# EAGLE schematic nomis-memory-game-v01 (EAGLE 6.0)
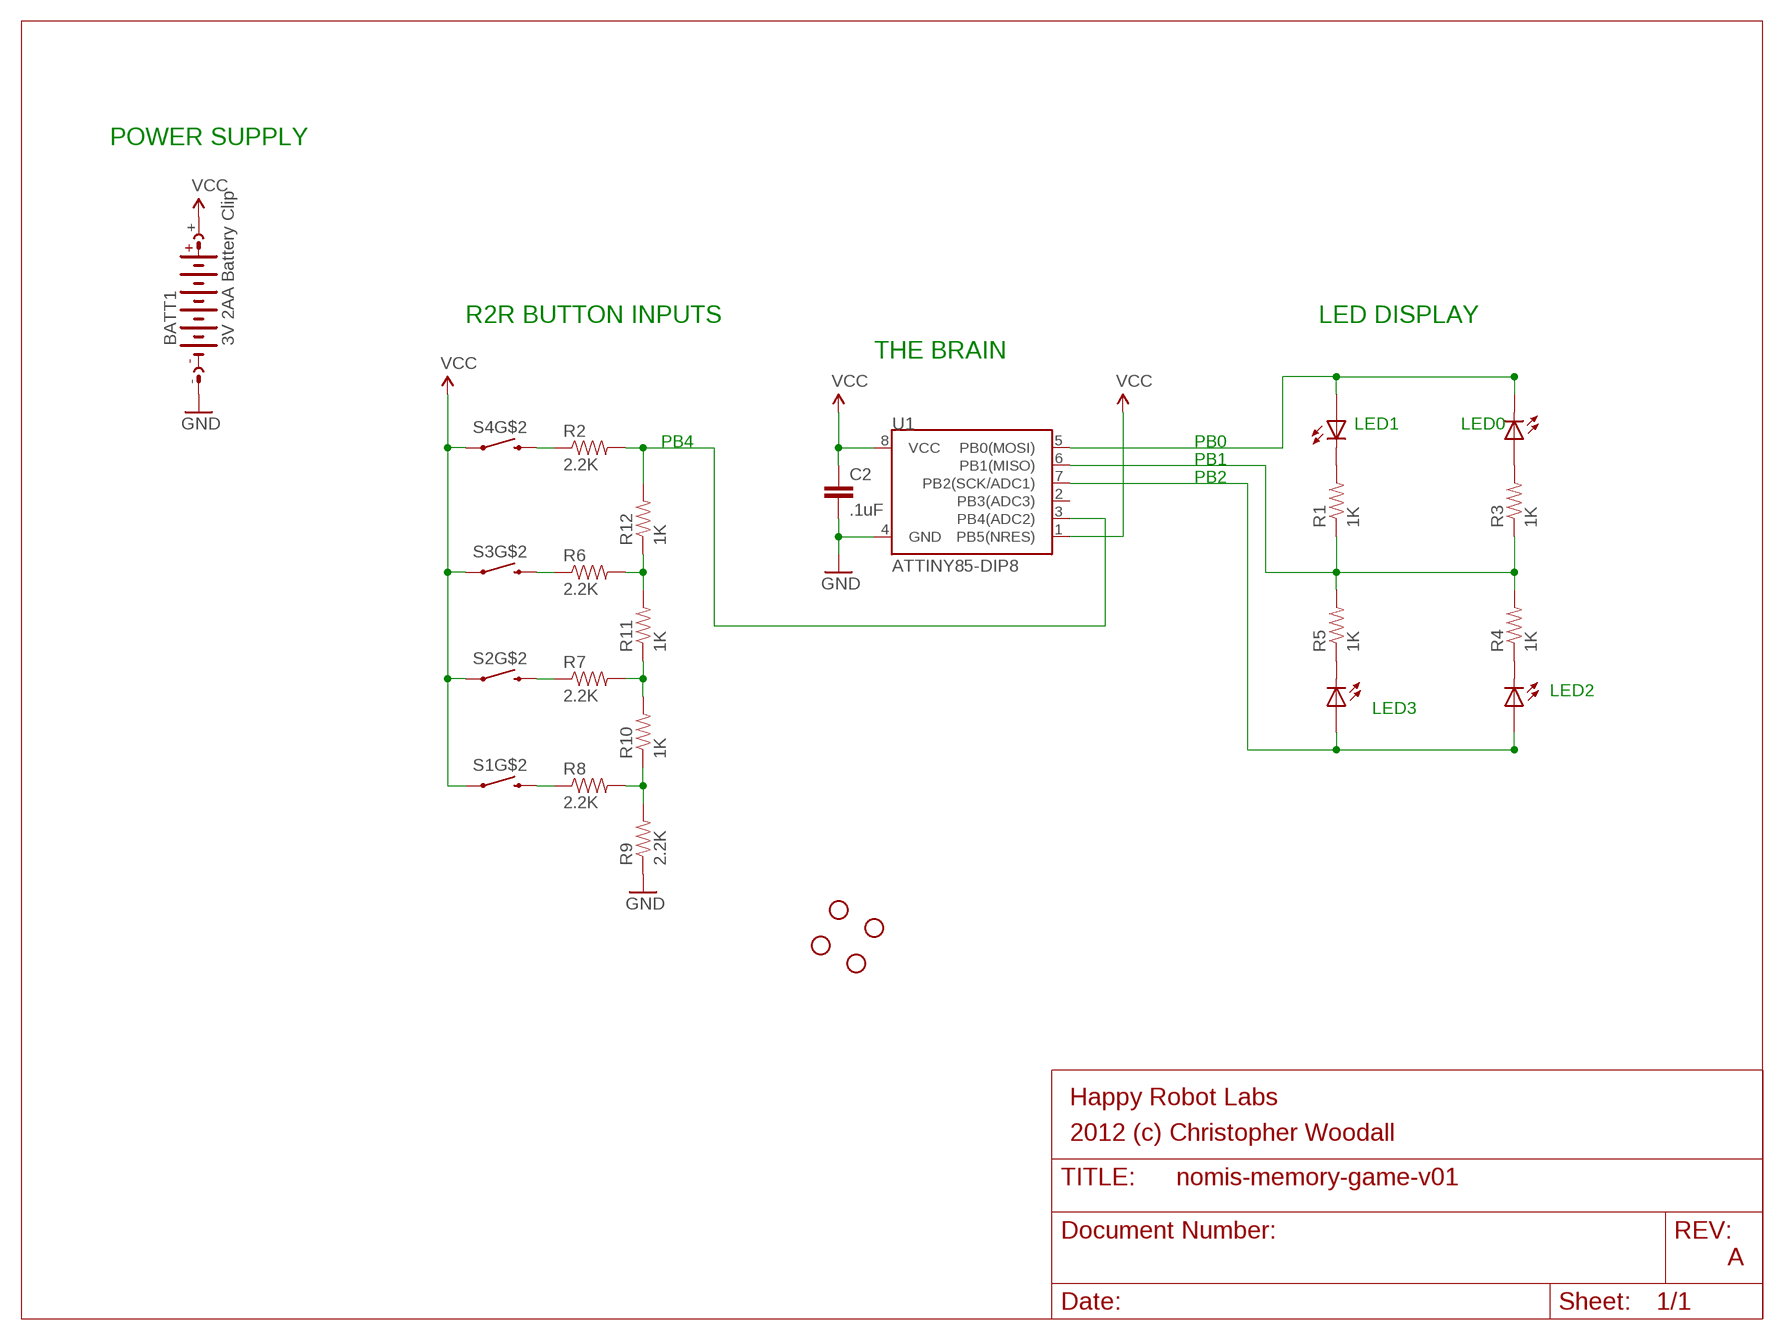
[diagram p0: schematic, sheet 1]

## Parts
BATT1  3V 2AA Battery Clip  AB9V  [AB9V]
C2  .1uF  CAPPTH  [CAP-PTH-SMALL]
JP1  STAND-OFFTIGHT  [STAND-OFF-TIGHT]
JP2  STAND-OFFTIGHT  [STAND-OFF-TIGHT]
JP3  STAND-OFFTIGHT  [STAND-OFF-TIGHT]
JP4  STAND-OFFTIGHT  [STAND-OFF-TIGHT]
R1  1K  RESISTORPTH-1/4W  [AXIAL-0.4]
R2  2.2K  RESISTORPTH-1/4W  [AXIAL-0.4]
R3  1K  RESISTORPTH-1/4W  [AXIAL-0.4]
R4  1K  RESISTORPTH-1/4W  [AXIAL-0.4]
R5  1K  RESISTORPTH-1/4W  [AXIAL-0.4]
R6  2.2K  RESISTORPTH-1/4W  [AXIAL-0.4]
R7  2.2K  RESISTORPTH-1/4W  [AXIAL-0.4]
R8  2.2K  RESISTORPTH-1/4W  [AXIAL-0.4]
R9  2.2K  RESISTORPTH-1/4W  [AXIAL-0.4]
R10  1K  RESISTORPTH-1/4W  [AXIAL-0.4]
R11  1K  RESISTORPTH-1/4W  [AXIAL-0.4]
R12  1K  RESISTORPTH-1/4W  [AXIAL-0.4]
S1  SWITCH-MOMENTARY-LED-SPLIT  [TACTILE-PTH-LED-12MM]
S2  SWITCH-MOMENTARY-LED-SPLIT  [TACTILE-PTH-LED-12MM]
S3  SWITCH-MOMENTARY-LED-SPLIT  [TACTILE-PTH-LED-12MM]
S4  SWITCH-MOMENTARY-LED-SPLIT  [TACTILE-PTH-LED-12MM]
U1  ATTINY85-DIP8  ATTINY45DIP8  [DIP08]

## Nets
GND: BATT1.- C2.2 R9.P$1 U1.4(GND)
N$1: R3.P$2 S1.A
N$2: R1.P$2 S2.C
N$3: R4.P$1 S3.C
N$4: R5.P$1 S4.C
N$5: R1.P$1 R3.P$1 R4.P$2 R5.P$2 U1.6(PB1(MISO))
N$6: S3.A S4.A U1.7(PB2(SCK/ADC1))
N$7: S1.C S2.A U1.5(PB0(MOSI))
N$8: R8.P$2 R9.P$2 R10.P$1
N$9: R7.P$2 R10.P$2 R11.P$1
N$11: R2.P$2 R12.P$2 U1.3(PB4(ADC2))
N$12: R2.P$1 S4.3 S4.4
N$13: R6.P$1 S3.3 S3.4
N$14: R7.P$1 S2.3 S2.4
N$15: R8.P$1 S1.3 S1.4
N$16: R6.P$2 R11.P$2 R12.P$1
VCC: BATT1.+ C2.1 S1.1 S1.2 S2.1 S2.2 S3.1 S3.2 S4.1 S4.2 U1.1(PB5(NRES)) U1.8(VCC)
Unconnected: U1.2(PB3(ADC3))

## Notes on the sheet
- POWER SUPPLY
- R2R BUTTON INPUTS | LED DISPLAY
- THE BRAIN
- LED1 | LED0
- PB4 | PB0
- PB1
- PB2
- LED2
- LED3
- Happy Robot Labs
- 2012 (c) Christopher Woodall
- A

## Library data of the parts
BATT1 = battery:AB9V: 9-V BATTERY CLIP
C2 = SparkFun:CAP: Capacitor Standard 0603 ceramic capacitor, and 0.1" leaded capacitor.
JP1-JP4 = SparkFun:STAND-OFF: Stand Off This is the mechanical footprint for a #4 phillips button head screw. Use the keepout ring to avoid running the screw head into surrounding components. SKU : PRT-00447
R1-R12 = SparkFun:RESISTOR: Resistor Basic schematic elements and footprints for 0603, 1206, and PTH resistors.
S1-S4 = nomis-memory-game:SWITCH-MOMENTARY-LED-SPLIT
U1 = SparkFun:ATTINY45: Atmel ATTiny45